# EAGLE design rev1_0 (EAGLE 7.6.0)
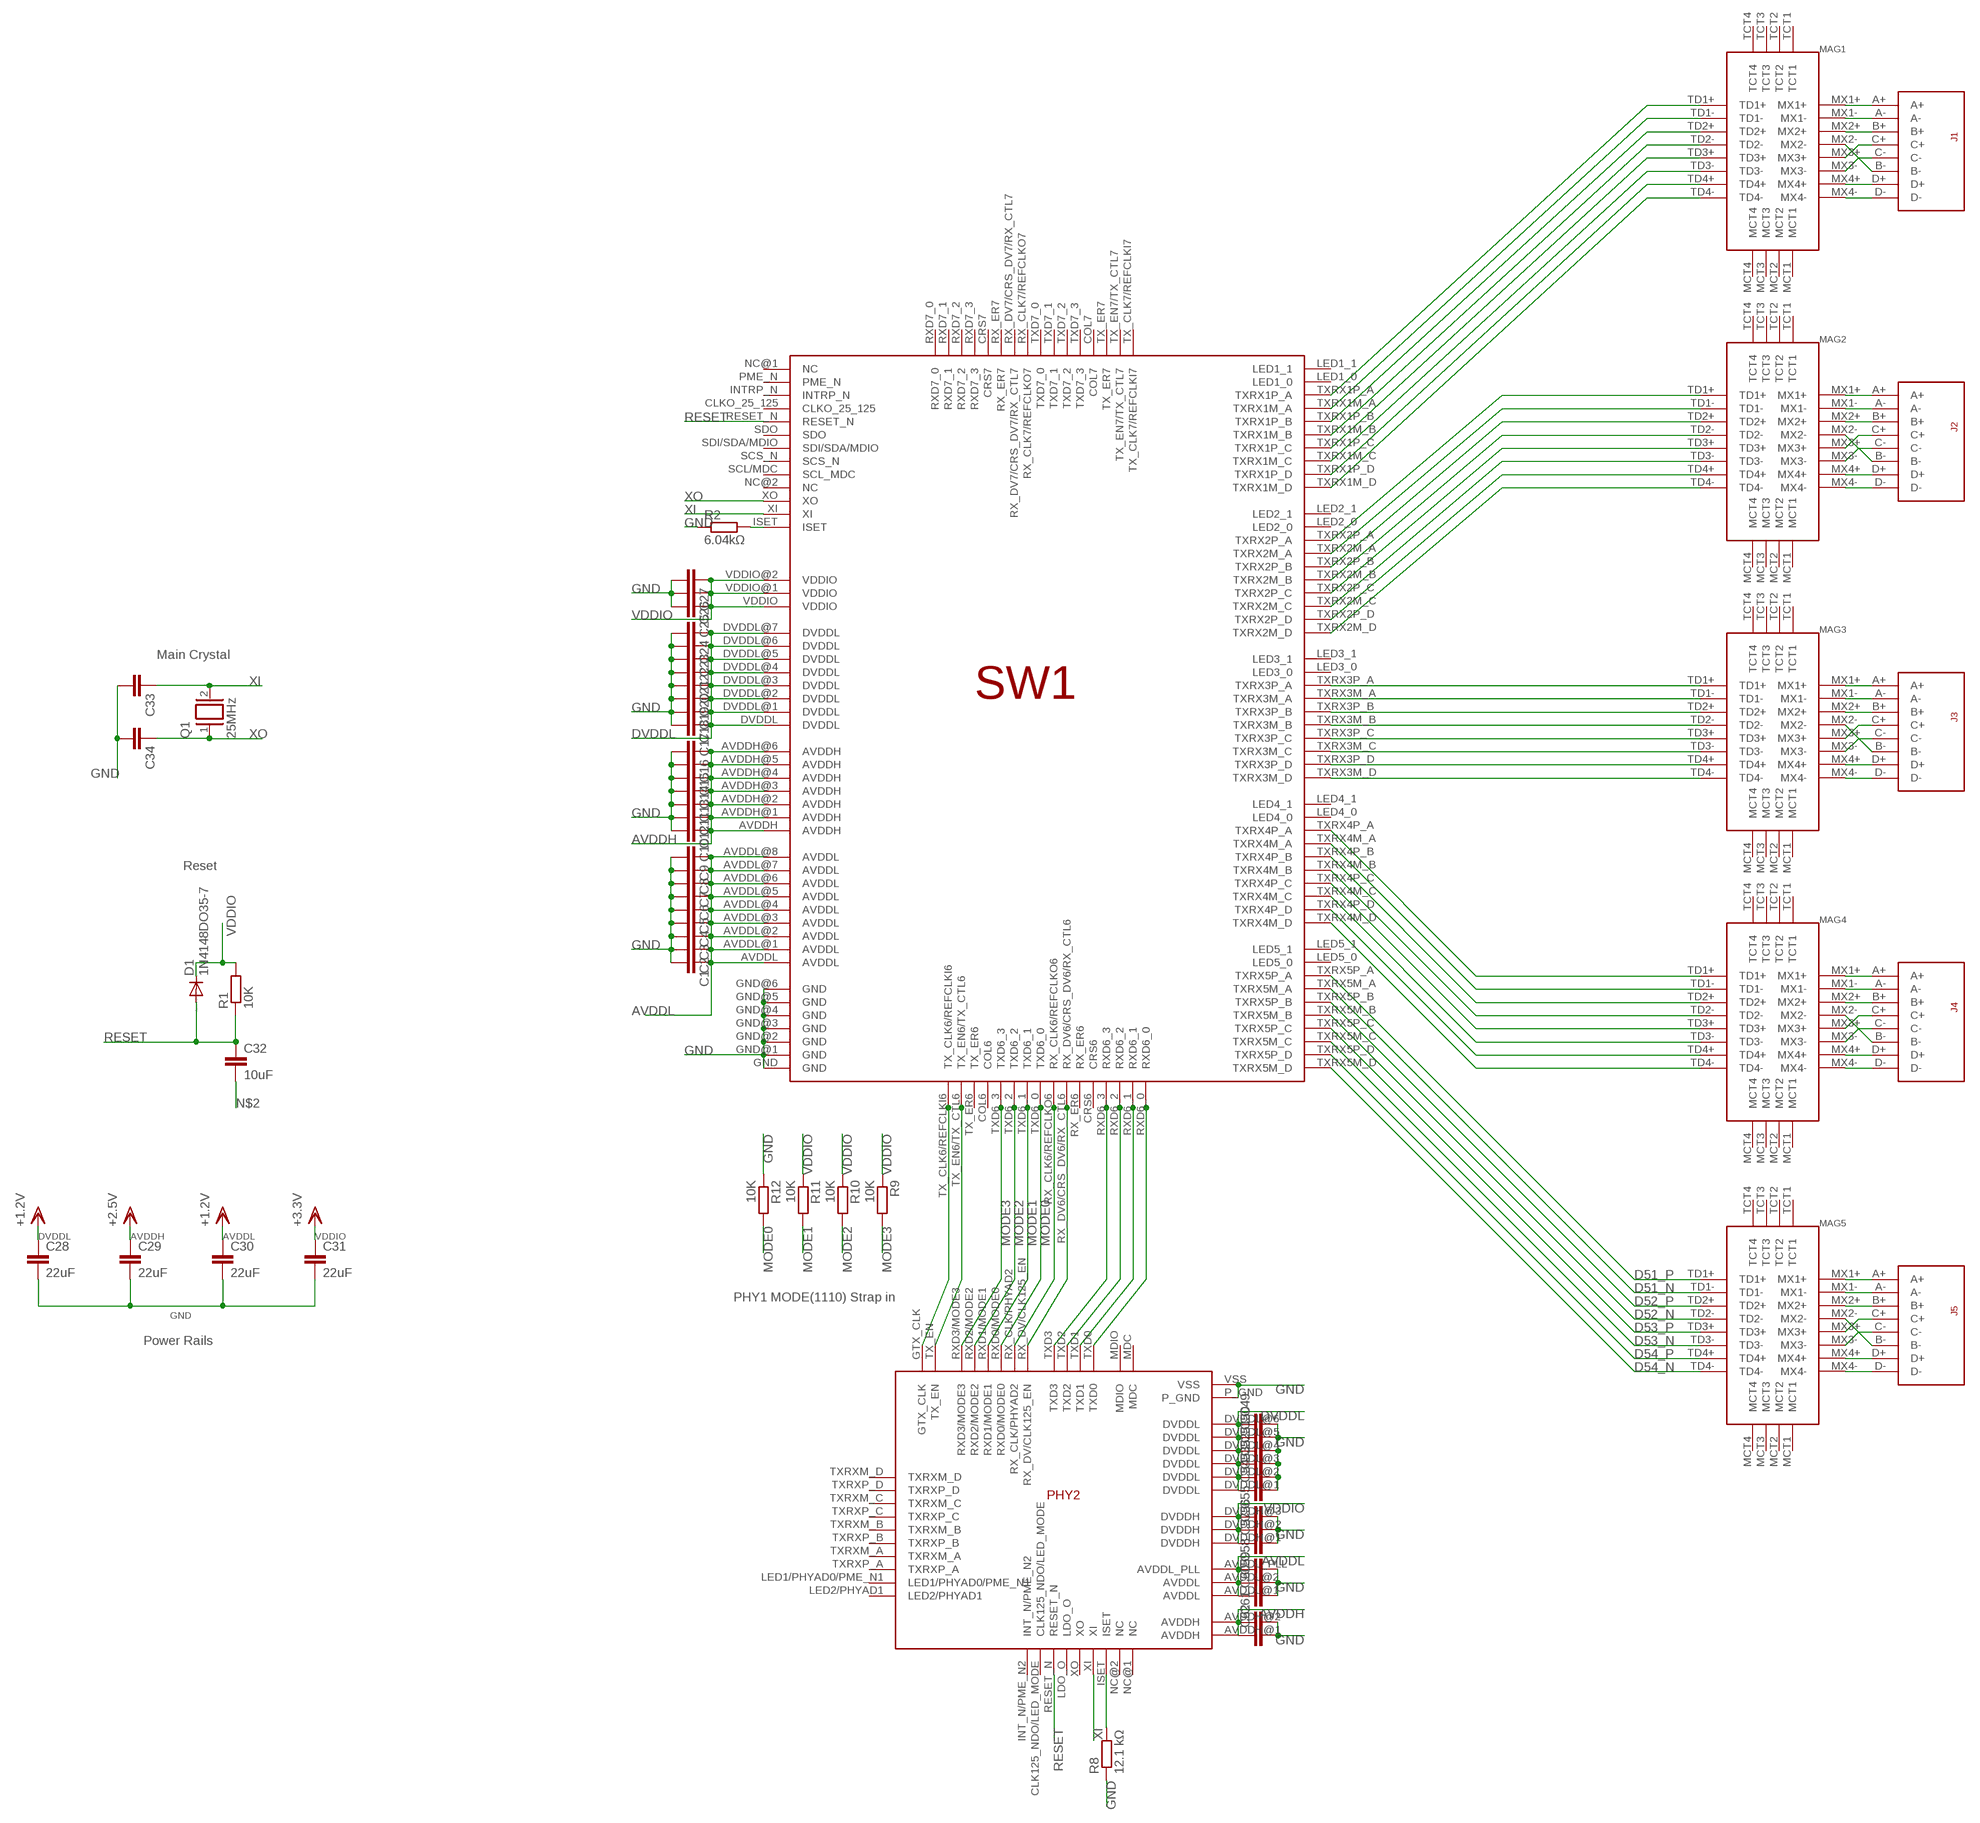
[diagram p0: schematic, sheet 1]

## Parts
C1  C-EUC0805  [C0805]
C2  C-EUC0805  [C0805]
C3  C-EUC0805  [C0805]
C4  C-EUC0805  [C0805]
C5  C-EUC0805  [C0805]
C6  C-EUC0805  [C0805]
C7  C-EUC0805  [C0805]
C8  C-EUC0805  [C0805]
C9  C-EUC0805  [C0805]
C10  C-EUC0805  [C0805]
C11  C-EUC0805  [C0805]
C12  C-EUC0805  [C0805]
C13  C-EUC0805  [C0805]
C14  C-EUC0805  [C0805]
C15  C-EUC0805  [C0805]
C16  C-EUC0805  [C0805]
C17  C-EUC0805  [C0805]
C18  C-EUC0805  [C0805]
C19  C-EUC0805  [C0805]
C20  C-EUC0805  [C0805]
C21  C-EUC0805  [C0805]
C22  C-EUC0805  [C0805]
C23  C-EUC0805  [C0805]
C24  C-EUC0805  [C0805]
C25  C-EUC0805  [C0805]
C26  C-EUC0805  [C0805]
C27  C-EUC0805  [C0805]
C28  22uF  C-EUC0805  [C0805]
C29  22uF  C-EUC0805  [C0805]
C30  22uF  C-EUC0805  [C0805]
C31  22uF  C-EUC0805  [C0805]
C32  10uF  C-EUC0805  [C0805]
C33  C-EUC0805  [C0805]
C34  C-EUC0805  [C0805]
C49  C-EUC0805  [C0805]
C50  C-EUC0805  [C0805]
C51  C-EUC0805  [C0805]
C52  C-EUC0805  [C0805]
C53  C-EUC0805  [C0805]
C54  C-EUC0805  [C0805]
C55  C-EUC0805  [C0805]
C56  C-EUC0805  [C0805]
C57  C-EUC0805  [C0805]
C58  C-EUC0805  [C0805]
C59  C-EUC0805  [C0805]
C60  C-EUC0805  [C0805]
C61  C-EUC0805  [C0805]
C62  C-EUC0805  [C0805]
D1  1N4148DO35-7  [DO35-7]
J1  AJP92A8813  [AJP92A8813]
J2  AJP92A8813  [AJP92A8813]
J3  AJP92A8813  [AJP92A8813]
J4  AJP92A8813  [AJP92A8813]
J5  AJP92A8813  [AJP92A8813]
MAG1  749020010A  [749023010A]
MAG2  749020010A  [749023010A]
MAG3  749020010A  [749023010A]
MAG4  749020010A  [749023010A]
MAG5  749020010A  [749023010A]
PHY2  KSZ9031RNX  [KSZ9031RNX]
Q1  25MHz  XTAL/S  [QS]
R1  10K  R-EU_R0805  [R0805]
R2  6.04kΩ  R-EU_R0805  [R0805]
R8  12.1 kΩ  R-EU_R0805  [R0805]
R9  10K  R-EU_R0805  [R0805]
R10  10K  R-EU_R0805  [R0805]
R11  10K  R-EU_R0805  [R0805]
R12  10K  R-EU_R0805  [R0805]
SW1  KSZ9897RTXC  [KSZ9897RTXC]

## Nets
AVDDH: C10.1 C11.1 C12.1 C13.1 C14.1 C15.1 C16.1 C29.1 PHY2.AVDDH@1(AVDDH) PHY2.AVDDH@2(AVDDH) SW1.AVDDH SW1.AVDDH@1(AVDDH) SW1.AVDDH@2(AVDDH) SW1.AVDDH@3(AVDDH) SW1.AVDDH@4(AVDDH) SW1.AVDDH@5(AVDDH) SW1.AVDDH@6(AVDDH) ; supply symbol labelled +2.5V
AVDDL: C1.1 C2.1 C3.1 C4.1 C5.1 C6.1 C7.1 C8.1 C9.1 C30.1 PHY2.AVDDL@1(AVDDL) PHY2.AVDDL@2(AVDDL) PHY2.AVDDL_PLL SW1.AVDDL SW1.AVDDL@1(AVDDL) SW1.AVDDL@2(AVDDL) SW1.AVDDL@3(AVDDL) SW1.AVDDL@4(AVDDL) SW1.AVDDL@5(AVDDL) SW1.AVDDL@6(AVDDL) SW1.AVDDL@7(AVDDL) SW1.AVDDL@8(AVDDL) ; supply symbol labelled +1.2V
D51_N [diff]: MAG5.TD1- SW1.TXRX5M_A
D51_P [diff]: MAG5.TD1+ SW1.TXRX5P_A
D52_N [diff]: MAG5.TD2- SW1.TXRX5M_B
D52_P [diff]: MAG5.TD2+ SW1.TXRX5P_B
D53_N [diff]: MAG5.TD3- SW1.TXRX5M_C
D53_P [diff]: MAG5.TD3+ SW1.TXRX5P_C
D54_N [diff]: MAG5.TD4- SW1.TXRX5M_D
D54_P [diff]: MAG5.TD4+ SW1.TXRX5P_D
DVDDL: C17.1 C24.1 C28.1 C49.1 PHY2.DVDDL@1(DVDDL) PHY2.DVDDL@2(DVDDL) PHY2.DVDDL@3(DVDDL) PHY2.DVDDL@4(DVDDL) PHY2.DVDDL@5(DVDDL) PHY2.DVDDL@6(DVDDL) SW1.DVDDL SW1.DVDDL@1(DVDDL) SW1.DVDDL@2(DVDDL) SW1.DVDDL@3(DVDDL) SW1.DVDDL@4(DVDDL) SW1.DVDDL@5(DVDDL) SW1.DVDDL@6(DVDDL) SW1.DVDDL@7(DVDDL) ; supply symbol labelled +1.2V
GND: C1.2 C2.2 C3.2 C4.2 C5.2 C6.2 C7.2 C8.2 C9.2 C10.2 C11.2 C12.2 C13.2 C14.2 C15.2 C16.2 C17.2 C18.2 C19.2 C20.2 C21.2 C22.2 C23.2 C24.2 C25.2 C26.2 C27.2 C28.2 C29.2 C30.2 C31.2 C33.2 C34.2 C49.2 C51.2 C52.2 C53.2 C54.2 C55.2 C57.2 C58.2 C60.2 C61.2 C62.2 PHY2.P_GND PHY2.VSS R2.1 R8.1 R12.1 SW1.GND SW1.GND@1(GND) SW1.GND@2(GND) SW1.GND@3(GND) SW1.GND@4(GND) SW1.GND@5(GND) SW1.GND@6(GND)
MODE0: PHY2.RXD0/MODE0 R12.2 SW1.TXD6_0
MODE1: PHY2.RXD1/MODE1 R11.2 SW1.TXD6_1
MODE2: PHY2.RXD2/MODE2 R10.2 SW1.TXD6_2
MODE3: PHY2.RXD3/MODE3 R9.2 SW1.TXD6_3
N$1: MAG1.TD1+ SW1.TXRX1P_A
N$2: C32.2
N$3: MAG1.TD1- SW1.TXRX1M_A
N$4: MAG1.TD2+ SW1.TXRX1P_B
N$5: MAG1.TD2- SW1.TXRX1M_B
N$14: R2.2 SW1.ISET
N$16: MAG1.TD3+ SW1.TXRX1P_C
N$17: MAG1.TD3- SW1.TXRX1M_C
N$18: MAG1.TD4+ SW1.TXRX1P_D
N$19: MAG1.TD4- SW1.TXRX1M_D
N$20: MAG2.TD1+ SW1.TXRX2P_A
N$21: MAG2.TD1- SW1.TXRX2M_A
N$22: MAG2.TD2+ SW1.TXRX2P_B
N$23: MAG2.TD2- SW1.TXRX2M_B
N$24: MAG2.TD3+ SW1.TXRX2P_C
N$25: MAG2.TD3- SW1.TXRX2M_C
N$26: MAG2.TD4+ SW1.TXRX2P_D
N$27: MAG2.TD4- SW1.TXRX2M_D
N$28: MAG3.TD1+ SW1.TXRX3P_A
N$29: MAG3.TD1- SW1.TXRX3M_A
N$30: MAG3.TD2+ SW1.TXRX3P_B
N$31: MAG3.TD2- SW1.TXRX3M_B
N$32: MAG3.TD3+ SW1.TXRX3P_C
N$33: MAG3.TD3- SW1.TXRX3M_C
N$34: MAG3.TD4+ SW1.TXRX3P_D
N$35: MAG3.TD4- SW1.TXRX3M_D
N$44: MAG4.TD4- SW1.TXRX4M_D
N$45: MAG4.TD4+ SW1.TXRX4P_D
N$46: MAG4.TD3- SW1.TXRX4M_C
N$47: MAG4.TD3+ SW1.TXRX4P_C
N$48: MAG4.TD2- SW1.TXRX4M_B
N$49: MAG4.TD2+ SW1.TXRX4P_B
N$50: MAG4.TD1- SW1.TXRX4M_A
N$51: MAG4.TD1+ SW1.TXRX4P_A
N$52: J1.A+ MAG1.MX1+
N$53: J1.A- MAG1.MX1-
N$54: J1.B+ MAG1.MX2+
N$55: J1.B- MAG1.MX2-
N$56: J1.C+ MAG1.MX3+
N$57: J1.C- MAG1.MX3-
N$58: J1.D+ MAG1.MX4+
N$59: J1.D- MAG1.MX4-
N$60: J2.A+ MAG2.MX1+
N$61: J2.A- MAG2.MX1-
N$62: J2.B+ MAG2.MX2+
N$63: J2.B- MAG2.MX2-
N$64: J2.C+ MAG2.MX3+
N$65: J2.C- MAG2.MX3-
N$66: J2.D+ MAG2.MX4+
N$67: J2.D- MAG2.MX4-
N$68: J3.A+ MAG3.MX1+
N$69: J3.A- MAG3.MX1-
N$70: J3.B+ MAG3.MX2+
N$71: J3.B- MAG3.MX2-
N$72: J3.C+ MAG3.MX3+
N$73: J3.C- MAG3.MX3-
N$74: J3.D+ MAG3.MX4+
N$75: J3.D- MAG3.MX4-
N$76: J4.A+ MAG4.MX1+
N$77: J4.A- MAG4.MX1-
N$78: J4.B+ MAG4.MX2+
N$79: J4.B- MAG4.MX2-
N$80: J4.C+ MAG4.MX3+
N$81: J4.C- MAG4.MX3-
N$82: J4.D+ MAG4.MX4+
N$83: J4.D- MAG4.MX4-
N$84: J5.A+ MAG5.MX1+
N$85: J5.A- MAG5.MX1-
N$86: J5.B+ MAG5.MX2+
N$87: J5.B- MAG5.MX2-
N$88: J5.C+ MAG5.MX3+
N$89: J5.C- MAG5.MX3-
N$90: J5.D+ MAG5.MX4+
N$91: J5.D- MAG5.MX4-
N$92: PHY2.TXD0 SW1.RXD6_0
N$93: PHY2.TXD1 SW1.RXD6_1
N$94: PHY2.TXD2 SW1.RXD6_2
N$95: PHY2.TXD3 SW1.RXD6_3
N$96: PHY2.RX_DV/CLK125_EN SW1.RX_DV6/CRS_DV6/RX_CTL6
N$97: PHY2.RX_CLK/PHYAD2 SW1.RX_CLK6/REFCLKO6
N$98: PHY2.TX_EN SW1.TX_EN6/TX_CTL6
N$99: PHY2.GTX_CLK SW1.TX_CLK6/REFCLKI6
N$100: PHY2.ISET R8.2
RESET: C32.1 D1.A PHY2.RESET_N R1.1 SW1.RESET_N
VDDIO: C25.1 C26.1 C27.1 C31.1 D1.C PHY2.DVDDH@1(DVDDH) PHY2.DVDDH@2(DVDDH) PHY2.DVDDH@3(DVDDH) R1.2 R9.1 R10.1 R11.1 SW1.VDDIO SW1.VDDIO@1(VDDIO) SW1.VDDIO@2(VDDIO) ; supply symbol labelled +3.3V
XI: C33.1 PHY2.XI Q1.2 SW1.XI
XO: C34.1 Q1.1 SW1.XO
Unconnected: C18.1 C19.1 C20.1 C21.1 C22.1 C23.1 C50.1 C50.2 C51.1 C52.1 C53.1 C54.1 C55.1 C56.1 C56.2 C57.1 C58.1 C59.1 C59.2 C60.1 C61.1 C62.1 MAG1.MCT1 MAG1.MCT2 MAG1.MCT3 MAG1.MCT4 MAG1.TCT1 MAG1.TCT2 MAG1.TCT3 MAG1.TCT4 MAG2.MCT1 MAG2.MCT2 MAG2.MCT3 MAG2.MCT4 MAG2.TCT1 MAG2.TCT2 MAG2.TCT3 MAG2.TCT4 MAG3.MCT1 MAG3.MCT2 MAG3.MCT3 MAG3.MCT4 MAG3.TCT1 MAG3.TCT2 MAG3.TCT3 MAG3.TCT4 MAG4.MCT1 MAG4.MCT2 MAG4.MCT3 MAG4.MCT4 MAG4.TCT1 MAG4.TCT2 MAG4.TCT3 MAG4.TCT4 MAG5.MCT1 MAG5.MCT2 MAG5.MCT3 MAG5.MCT4 MAG5.TCT1 MAG5.TCT2 MAG5.TCT3 MAG5.TCT4 PHY2.CLK125_NDO/LED_MODE PHY2.INT_N/PME_N2 PHY2.LDO_O PHY2.LED1/PHYAD0/PME_N1 PHY2.LED2/PHYAD1 PHY2.MDC PHY2.MDIO PHY2.NC@1(NC) PHY2.NC@2(NC) PHY2.TXRXM_A PHY2.TXRXM_B PHY2.TXRXM_C PHY2.TXRXM_D PHY2.TXRXP_A PHY2.TXRXP_B PHY2.TXRXP_C PHY2.TXRXP_D PHY2.XO SW1.CLKO_25_125 SW1.COL6 SW1.COL7 SW1.CRS6 SW1.CRS7 SW1.INTRP_N SW1.LED1_0 SW1.LED1_1 SW1.LED2_0 SW1.LED2_1 SW1.LED3_0 SW1.LED3_1 SW1.LED4_0 SW1.LED4_1 SW1.LED5_0 SW1.LED5_1 SW1.NC@1(NC) SW1.NC@2(NC) SW1.PME_N SW1.RX_CLK7/REFCLKO7 SW1.RX_DV7/CRS_DV7/RX_CTL7 SW1.RX_ER6 SW1.RX_ER7 SW1.RXD7_0 SW1.RXD7_1 SW1.RXD7_2 SW1.RXD7_3 SW1.SCL/MDC(SCL_MDC) SW1.SCS_N SW1.SDI/SDA/MDIO SW1.SDO SW1.TX_CLK7/REFCLKI7 SW1.TX_EN7/TX_CTL7 SW1.TX_ER6 SW1.TX_ER7 SW1.TXD7_0 SW1.TXD7_1 SW1.TXD7_2 SW1.TXD7_3

## Notes on the sheet
- Main Crystal
- Reset
- PHY1 MODE(1110) Strap in
- Power Rails

## Library data of the parts
C1-C31 C33 C34 C49-C62 = rcl:C-EU: CAPACITOR, European symbol
C32 = resistor:C-EU: CAPACITOR, European symbol
D1 = diode:1N4148: DIODE high speed (Philips)
J1-J5 = AJP92A8813:AJP92A8813
MAG1-MAG5 = 749023010A:749020010A
PHY2 = KSZ9031RNX:KSZ9031RNX
Q1 = special:XTAL/S: CRYSTAL
R1 R2 R8-R12 = resistor:R-EU_: RESISTOR, European symbol
SW1 = KSZ9897RTXC:KSZ9897RTXC

## Net classes
1 diff: width 0.127 mm, drill 0.3 mm, clearance 0.508 mm to class 0, clearance 0.127 mm

## Board
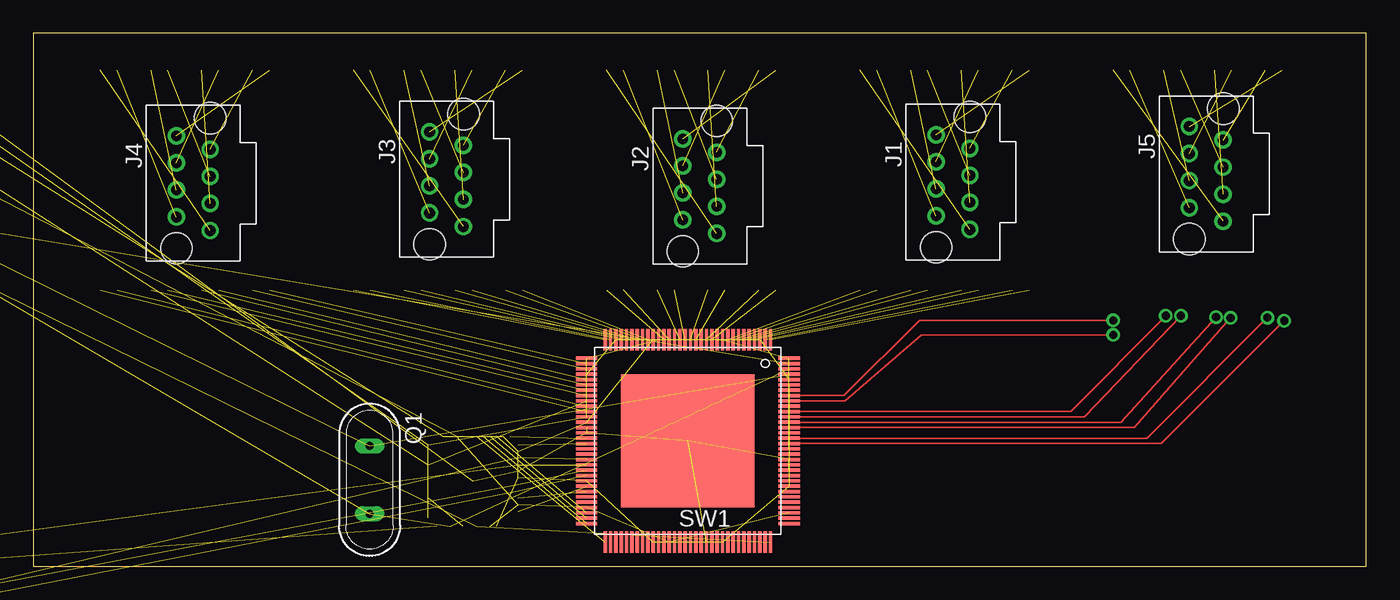
[diagram p1: board, top side]
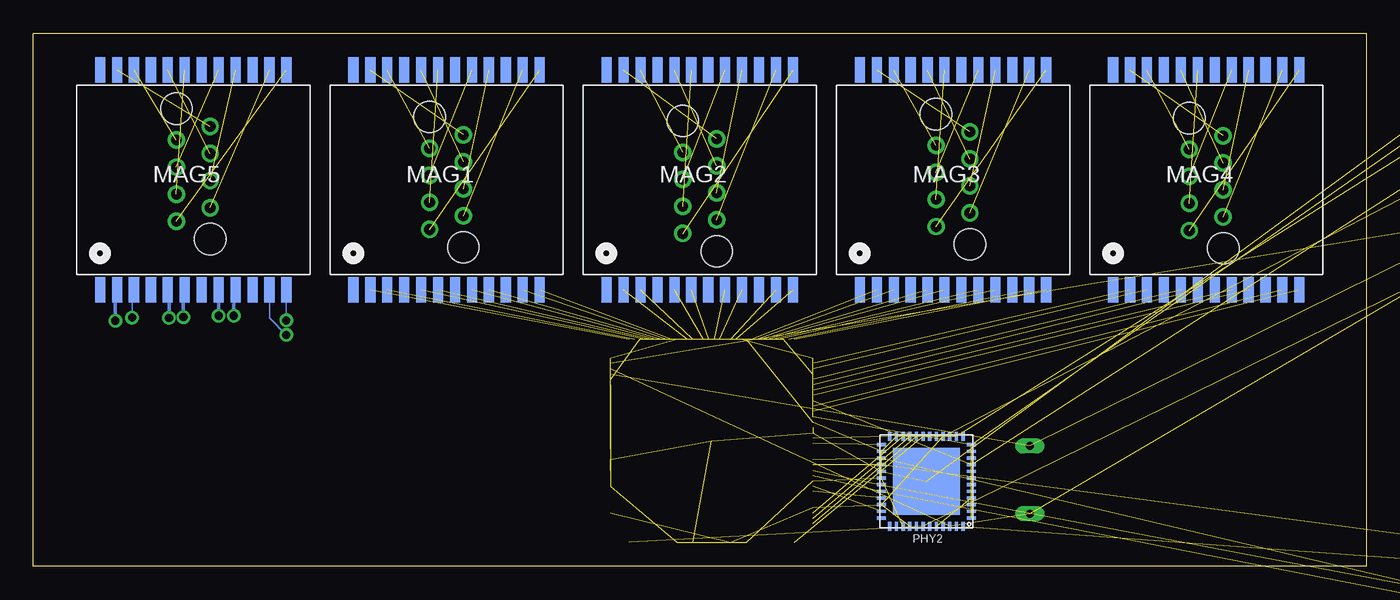
[diagram p2: board, bottom side, seen from below]

Size 100 x 40 mm. Coordinates in mm from the lower left corner, seen from the top.
Outline: 0,0 100,0 100,40 0,40 0,0
Copper layers (1*16): Top 0.035mm / dielectric 1.5mm / Bottom 0.035mm
Design rules "default *": minimum track width 5mil, minimum drill 24mil, track to track 8mil, track to pad 8mil, pad to pad 8mil, via to via 8mil, smd to smd 8mil, copper to edge 40mil, drill to drill 8mil, minimum pad ring 10mil, minimum via ring 8mil, stop-mask expansion 4mil, vias tented up to drill 0mil, thermal gap 10mil

### Footprints (pad centres in the part's own frame; a part is rotated, then mirrored left to right if it is on the bottom)
C0805 = smd 1.3 x 1.5: 1 -0.95,0; 2 0.95,0
DO35-7 = drill 0.813 long: A 3.81,0; C -3.81,0
AJP92A8813 = drill 0.8: A+ -3.556,-1.27; A- -2.54,1.27; B+ -1.524,-1.27; B- 1.524,1.27; C+ -0.508,1.27; C- 0.508,-1.27; D+ 2.54,-1.27; D- 3.556,1.27 | hole 2.36: -4.89,1.27; 4.89,-1.27
749023010A = smd 0.76 x 1.9: MCT1 -6.985,8.25; MCT2 -3.175,8.25; MCT3 0.635,8.25; MCT4 4.445,8.25; MX1+ -5.715,8.25; MX1- -4.445,8.25; MX2+ -1.905,8.25; MX2- -0.635,8.25; MX3+ 1.905,8.25; MX3- 3.175,8.25; MX4+ 5.715,8.25; MX4- 6.985,8.25; TCT1 -6.985,-8.25; TCT2 -3.175,-8.25; TCT3 0.635,-8.25; TCT4 4.445,-8.25; TD1+ -5.715,-8.25; TD1- -4.445,-8.25; TD2+ -1.905,-8.25; TD2- -0.635,-8.25; TD3+ 1.905,-8.25; TD3- 3.175,-8.25; TD4+ 5.715,-8.25; TD4- 6.985,-8.25
KSZ9031RNX = smd 0.65 x 0.25: AVDDH@1 -3.375,2.75; AVDDH@2 -3.375,-2.75; AVDDL@1 -3.375,1.25; AVDDL@2 -3.375,-1.25; DVDDH@2 3.375,1.75; DVDDL@4 3.375,-2.25; DVDDL@5 3.375,-0.25; MDC 3.375,2.75; RX_CLK/PHYAD2 3.375,2.25; RX_DV/CLK125_EN 3.375,1.25; RXD0/MODE0 3.375,0.75; RXD1/MODE1 3.375,0.25; RXD2/MODE2 3.375,-1.25; RXD3/MODE3 3.375,-1.75; TX_EN 3.375,-2.75; TXRXM_A -3.375,1.75; TXRXM_B -3.375,0.25; TXRXM_C -3.375,-0.75; TXRXM_D -3.375,-2.25; TXRXP_A -3.375,2.25; TXRXP_B -3.375,0.75; TXRXP_C -3.375,-0.25; TXRXP_D -3.375,-1.75; VSS 3.375,-0.75 | smd 0.25 x 0.65: AVDDL_PLL -0.75,3.375; CLK125_NDO/LED_MODE 0.75,3.375; DVDDH@1 -1.25,-3.375; DVDDH@3 1.25,3.375; DVDDL@1 -2.25,-3.375; DVDDL@2 -0.25,-3.375; DVDDL@3 2.25,-3.375; DVDDL@6 1.75,3.375; GTX_CLK 2.75,-3.375; INT_N/PME_N2 2.25,3.375; ISET -2.75,3.375; LDO_O -0.25,3.375; LED1/PHYAD0/PME_N1 -0.75,-3.375; LED2/PHYAD1 -1.75,-3.375; MDIO 2.75,3.375; NC@1 -2.75,-3.375; NC@2 -2.25,3.375; RESET_N 0.25,3.375; TXD0 0.25,-3.375; TXD1 0.75,-3.375; TXD2 1.25,-3.375; TXD3 1.75,-3.375; XI -1.75,3.375; XO -1.25,3.375 | smd 5.05 x 5.05: P_GND 0,0
QS = drill 0.61 long: 1 -2.54,0; 2 2.54,0
R0805 = smd 1.3 x 1.5: 1 -0.95,0; 2 0.95,0
KSZ9897RTXC = smd 1.6 x 0.25: AVDDH 7.6,-1.8; AVDDH@3 7.6,-6.2; AVDDH@4 -7.6,0.6; AVDDH@5 -7.6,-3.8; AVDDH@6 -7.6,-6.2; AVDDL -7.6,-2.6; AVDDL@5 7.6,-5; AVDDL@6 7.6,-3; AVDDL@7 -7.6,-0.6; AVDDL@8 -7.6,-4.6; COL6 7.6,1; CRS6 7.6,4.6; DVDDL 7.6,-1.4; DVDDL@3 7.6,3; DVDDL@6 -7.6,3.4; DVDDL@7 -7.6,1; GND@2 7.6,-1; GND@3 7.6,-0.6; GND@4 -7.6,2.2; GND@5 -7.6,1.4; GND@6 -7.6,-4.2; ISET -7.6,-5.8; LED1_0 -7.6,3; LED1_1 -7.6,2.6; LED5_0 -7.6,4.2; LED5_1 -7.6,3.8; NC@2 -7.6,1.8; RX_CLK6/REFCLKO6 7.6,3.4; RX_DV6/CRS_DV6/RX_CTL6 7.6,3.8; RX_ER6 7.6,4.2; RXD6_1 7.6,6.2; RXD6_2 7.6,5.8; RXD6_3 7.6,5.4; SCL/MDC -7.6,4.6; SCS_N -7.6,5; SDI/SDA/MDIO -7.6,5.8; SDO -7.6,6.2; TX_CLK6/REFCLKI6 7.6,-0.2; TX_EN6/TX_CTL6 7.6,0.2; TX_ER6 7.6,0.6; TXD6_0 7.6,2.6; TXD6_1 7.6,2.2; TXD6_2 7.6,1.8; TXD6_3 7.6,1.4; TXRX4M_A 7.6,-5.4; TXRX4M_B 7.6,-4.2; TXRX4M_C 7.6,-3.4; TXRX4M_D 7.6,-2.2; TXRX4P_A 7.6,-5.8; TXRX4P_B 7.6,-4.6; TXRX4P_C 7.6,-3.8; TXRX4P_D 7.6,-2.6; TXRX5M_A -7.6,-0.2; TXRX5M_B -7.6,-1.4; TXRX5M_C -7.6,-2.2; TXRX5M_D -7.6,-3.4; TXRX5P_A -7.6,0.2; TXRX5P_B -7.6,-1; TXRX5P_C -7.6,-1.8; TXRX5P_D -7.6,-3; VDDIO -7.6,5.4; VDDIO@1 7.6,5; XI -7.6,-5.4; XO -7.6,-5 | smd 0.25 x 1.6: AVDDH@1 -2.6,-7.6; AVDDH@2 2.2,-7.6; AVDDL@1 -5.4,-7.6; AVDDL@2 -1,-7.6; AVDDL@3 1,-7.6; AVDDL@4 5.4,-7.6; CLKO_25_125 -5.8,7.6; COL7 4.6,7.6; CRS7 0.6,7.6; DVDDL@1 -2.2,-7.6; DVDDL@2 2.6,-7.6; DVDDL@4 2.6,7.6; DVDDL@5 -2.6,7.6; GND -1.4,7.6; INTRP_N -5.4,7.6; LED2_0 -4.2,7.6; LED2_1 -4.6,7.6; LED3_0 -3,7.6; LED3_1 -3.4,7.6; LED4_0 -1.8,7.6; LED4_1 -2.2,7.6; NC@1 -3.8,7.6; PME_N -5,7.6; RESET_N -6.2,7.6; RX_CLK7/REFCLKO7 2.2,7.6; RX_DV7/CRS_DV7/RX_CTL7 1.8,7.6; RX_ER7 1,7.6; RXD6_0 6.2,7.6; RXD7_0 -1,7.6; RXD7_1 -0.6,7.6; RXD7_2 -0.2,7.6; RXD7_3 0.2,7.6; TX_CLK7/REFCLKI7 5.8,7.6; TX_EN7/TX_CTL7 5.4,7.6; TX_ER7 5,7.6; TXD7_0 3,7.6; TXD7_1 3.4,7.6; TXD7_2 3.8,7.6; TXD7_3 4.2,7.6; TXRX1M_A -5.8,-7.6; TXRX1M_B -4.6,-7.6; TXRX1M_C -3.8,-7.6; TXRX1M_D -3,-7.6; TXRX1P_A -6.2,-7.6; TXRX1P_B -5,-7.6; TXRX1P_C -4.2,-7.6; TXRX1P_D -3.4,-7.6; TXRX2M_A -1.4,-7.6; TXRX2M_B -0.2,-7.6; TXRX2M_C 0.6,-7.6; TXRX2M_D 1.8,-7.6; TXRX2P_A -1.8,-7.6; TXRX2P_B -0.6,-7.6; TXRX2P_C 0.2,-7.6; TXRX2P_D 1.4,-7.6; TXRX3M_A 3.4,-7.6; TXRX3M_B 4.2,-7.6; TXRX3M_C 5,-7.6; TXRX3M_D 6.2,-7.6; TXRX3P_A 3,-7.6; TXRX3P_B 3.8,-7.6; TXRX3P_C 4.6,-7.6; TXRX3P_D 5.8,-7.6; VDDIO@2 1.4,7.6 | smd 10 x 10: GND@1 0,0

### Placement (x,y rotation side)
C1  -35.56,62.23 0 top  (outside the outline)
C2  -40.64,62.23 0 top  (outside the outline)
C3  -45.72,62.23 0 top  (outside the outline)
C4  -50.8,62.23 0 top  (outside the outline)
C5  -55.88,62.23 0 top  (outside the outline)
C6  -60.96,62.23 0 top  (outside the outline)
C7  -15.24,67.31 0 top  (outside the outline)
C8  -20.32,67.31 0 top  (outside the outline)
C9  -25.4,67.31 0 top  (outside the outline)
C10  -15.24,46.99 0 top  (outside the outline)
C11  -20.32,46.99 0 top  (outside the outline)
C12  -25.4,46.99 0 top  (outside the outline)
C13  -30.48,46.99 0 top  (outside the outline)
C14  -35.56,46.99 0 top  (outside the outline)
C15  -40.64,46.99 0 top  (outside the outline)
C16  -45.72,46.99 0 top  (outside the outline)
C17  -50.8,46.99 0 top  (outside the outline)
C18  -55.88,46.99 0 top  (outside the outline)
C19  -60.96,46.99 0 top  (outside the outline)
C20  -15.24,52.07 0 top  (outside the outline)
C21  -20.32,52.07 0 top  (outside the outline)
C22  -25.4,52.07 0 top  (outside the outline)
C23  -30.48,52.07 0 top  (outside the outline)
C24  -35.56,52.07 0 top  (outside the outline)
C25  -40.64,52.07 0 top  (outside the outline)
C26  -45.72,52.07 0 top  (outside the outline)
C27  -50.8,52.07 0 top  (outside the outline)
C28  -58.42,33.02 0 top  (outside the outline)
C29  -16.51,41.91 0 top  (outside the outline)
C30  -22.86,41.91 0 top  (outside the outline)
C31  -29.21,41.91 0 top  (outside the outline)
C32  -35.56,41.91 0 top  (outside the outline)
C33  -55.88,52.07 0 top  (outside the outline)
C34  -60.96,52.07 0 top  (outside the outline)
C49  -45,-12 0 top  (outside the outline)
C50  -60,-19 0 top  (outside the outline)
C51  -55,-19 0 top  (outside the outline)
C52  -50,-19 0 top  (outside the outline)
C53  -45,-19 0 top  (outside the outline)
C54  -60,-23 0 top  (outside the outline)
C55  -55,-23 0 top  (outside the outline)
C56  -50,-23 0 top  (outside the outline)
C57  -45,-23 0 top  (outside the outline)
C58  -60,-27 0 top  (outside the outline)
C59  -55,-27 0 top  (outside the outline)
C60  -50,-27 0 top  (outside the outline)
C61  -45,-27 0 top  (outside the outline)
C62  -60,-31 0 top  (outside the outline)
D1  -31.75,33.02 0 top  (outside the outline)
J1  69,28.83 270 top
J2  50,28.53 270 top
J3  31,29.05 270 top
J4  12,28.75 270 top
J5  88,29.45 270 top
MAG1  69,29 0 bottom
MAG2  50,29 0 bottom
MAG3  31,29 0 bottom
MAG4  12,29 0 bottom
MAG5  88,29 0 bottom
PHY2  33,6.37 180 bottom
Q1  25.23,6.48 270 top
R1  -40.64,41.91 0 top  (outside the outline)
R2  -52.07,33.02 0 top  (outside the outline)
R8  -53,-3 0 top  (outside the outline)
R9  -50,-12 0 top  (outside the outline)
R10  -44,-3 0 top  (outside the outline)
R11  -60,-12 0 top  (outside the outline)
R12  -55,-12 0 top  (outside the outline)
SW1  49.11,9.41 180 top

### Tracks (layer width: path | path; a pad name or v marks a point on that pad's centre or on a via)
AVDDH  (16 unrouted)
AVDDL  (21 unrouted)
D51_N  (via drill 0.61)
  Top 0.127: SW1.TXRX5M_A 83.55,9.61 v92.59,18.66
  Bottom 0.127: v92.59,18.66 92.59,20.6 MAG5.TD1-
D51_P  (via drill 0.61)
  Top 0.127: SW1.TXRX5P_A 84.63,9.21 v93.84,18.43
  Bottom 0.254: v93.84,18.43 93.84,20.62 MAG5.TD1+
D52_N  (via drill 0.61)
  Top 0.127: SW1.TXRX5M_B 81.61,10.81 v88.74,18.7
  Bottom 0.254: v88.74,18.7 88.74,20.65 MAG5.TD2-
D52_P  (via drill 0.61)
  Top 0.127: SW1.TXRX5P_B 82.61,10.41 v89.82,18.63
  Bottom 0.254: v89.82,18.63 89.82,20.67 MAG5.TD2+
D53_N  (via drill 0.61)
  Top 0.127: SW1.TXRX5M_C 77.83,11.61 v84.96,18.8
  Bottom 0.254: v84.96,18.8 84.93,20.65 MAG5.TD3-
D53_P  (via drill 0.61)
  Top 0.127: SW1.TXRX5P_C 78.84,11.21 v86.11,18.8
  Bottom 0.254: 86.01,20.67 MAG5.TD3+ 86.11,20.74 v86.11,18.8
D54_N  (via drill 0.61)
  Top 0.127: SW1.TXRX5M_D 60.84,12.81 66.48,18.45 v81.03,18.45
  Bottom 0.127: v81.03,18.45 MAG5.TD4-
D54_P  (via drill 0.61)
  Top 0.127: SW1.TXRX5P_D 60.9,12.41 66.62,17.36 v81.03,17.36
  Bottom 0.127: v81.03,17.36 82.28,18.62 MAG5.TD4+
DVDDL  (17 unrouted)
GND  (55 unrouted)
MODE0  (2 unrouted)
MODE1  (2 unrouted)
MODE2  (2 unrouted)
MODE3  (2 unrouted)
N$1  (1 unrouted)
N$3  (1 unrouted)
N$4  (1 unrouted)
N$5  (1 unrouted)
N$14  (1 unrouted)
N$16  (1 unrouted)
N$17  (1 unrouted)
N$18  (1 unrouted)
N$19  (1 unrouted)
N$20  (1 unrouted)
N$21  (1 unrouted)
N$22  (1 unrouted)
N$23  (1 unrouted)
N$24  (1 unrouted)
N$25  (1 unrouted)
N$26  (1 unrouted)
N$27  (1 unrouted)
N$28  (1 unrouted)
N$29  (1 unrouted)
N$30  (1 unrouted)
N$31  (1 unrouted)
N$32  (1 unrouted)
N$33  (1 unrouted)
N$34  (1 unrouted)
N$35  (1 unrouted)
N$44  (1 unrouted)
N$45  (1 unrouted)
N$46  (1 unrouted)
N$47  (1 unrouted)
N$48  (1 unrouted)
N$49  (1 unrouted)
N$50  (1 unrouted)
N$51  (1 unrouted)
N$52  (1 unrouted)
N$53  (1 unrouted)
N$54  (1 unrouted)
N$55  (1 unrouted)
N$56  (1 unrouted)
N$57  (1 unrouted)
N$58  (1 unrouted)
N$59  (1 unrouted)
N$60  (1 unrouted)
N$61  (1 unrouted)
N$62  (1 unrouted)
N$63  (1 unrouted)
N$64  (1 unrouted)
N$65  (1 unrouted)
N$66  (1 unrouted)
N$67  (1 unrouted)
N$68  (1 unrouted)
N$69  (1 unrouted)
N$70  (1 unrouted)
N$71  (1 unrouted)
N$72  (1 unrouted)
N$73  (1 unrouted)
N$74  (1 unrouted)
N$75  (1 unrouted)
N$76  (1 unrouted)
N$77  (1 unrouted)
N$78  (1 unrouted)
N$79  (1 unrouted)
N$80  (1 unrouted)
N$81  (1 unrouted)
N$82  (1 unrouted)
N$83  (1 unrouted)
N$84  (1 unrouted)
N$85  (1 unrouted)
N$86  (1 unrouted)
N$87  (1 unrouted)
N$88  (1 unrouted)
N$89  (1 unrouted)
N$90  (1 unrouted)
N$91  (1 unrouted)
N$92  (1 unrouted)
N$93  (1 unrouted)
N$94  (1 unrouted)
N$95  (1 unrouted)
N$96  (1 unrouted)
N$97  (1 unrouted)
N$98  (1 unrouted)
N$99  (1 unrouted)
N$100  (1 unrouted)
RESET  (4 unrouted)
VDDIO  (14 unrouted)
XI  (3 unrouted)
XO  (2 unrouted)